# EAGLE schematic matrix mixer (EAGLE 8.2.1)
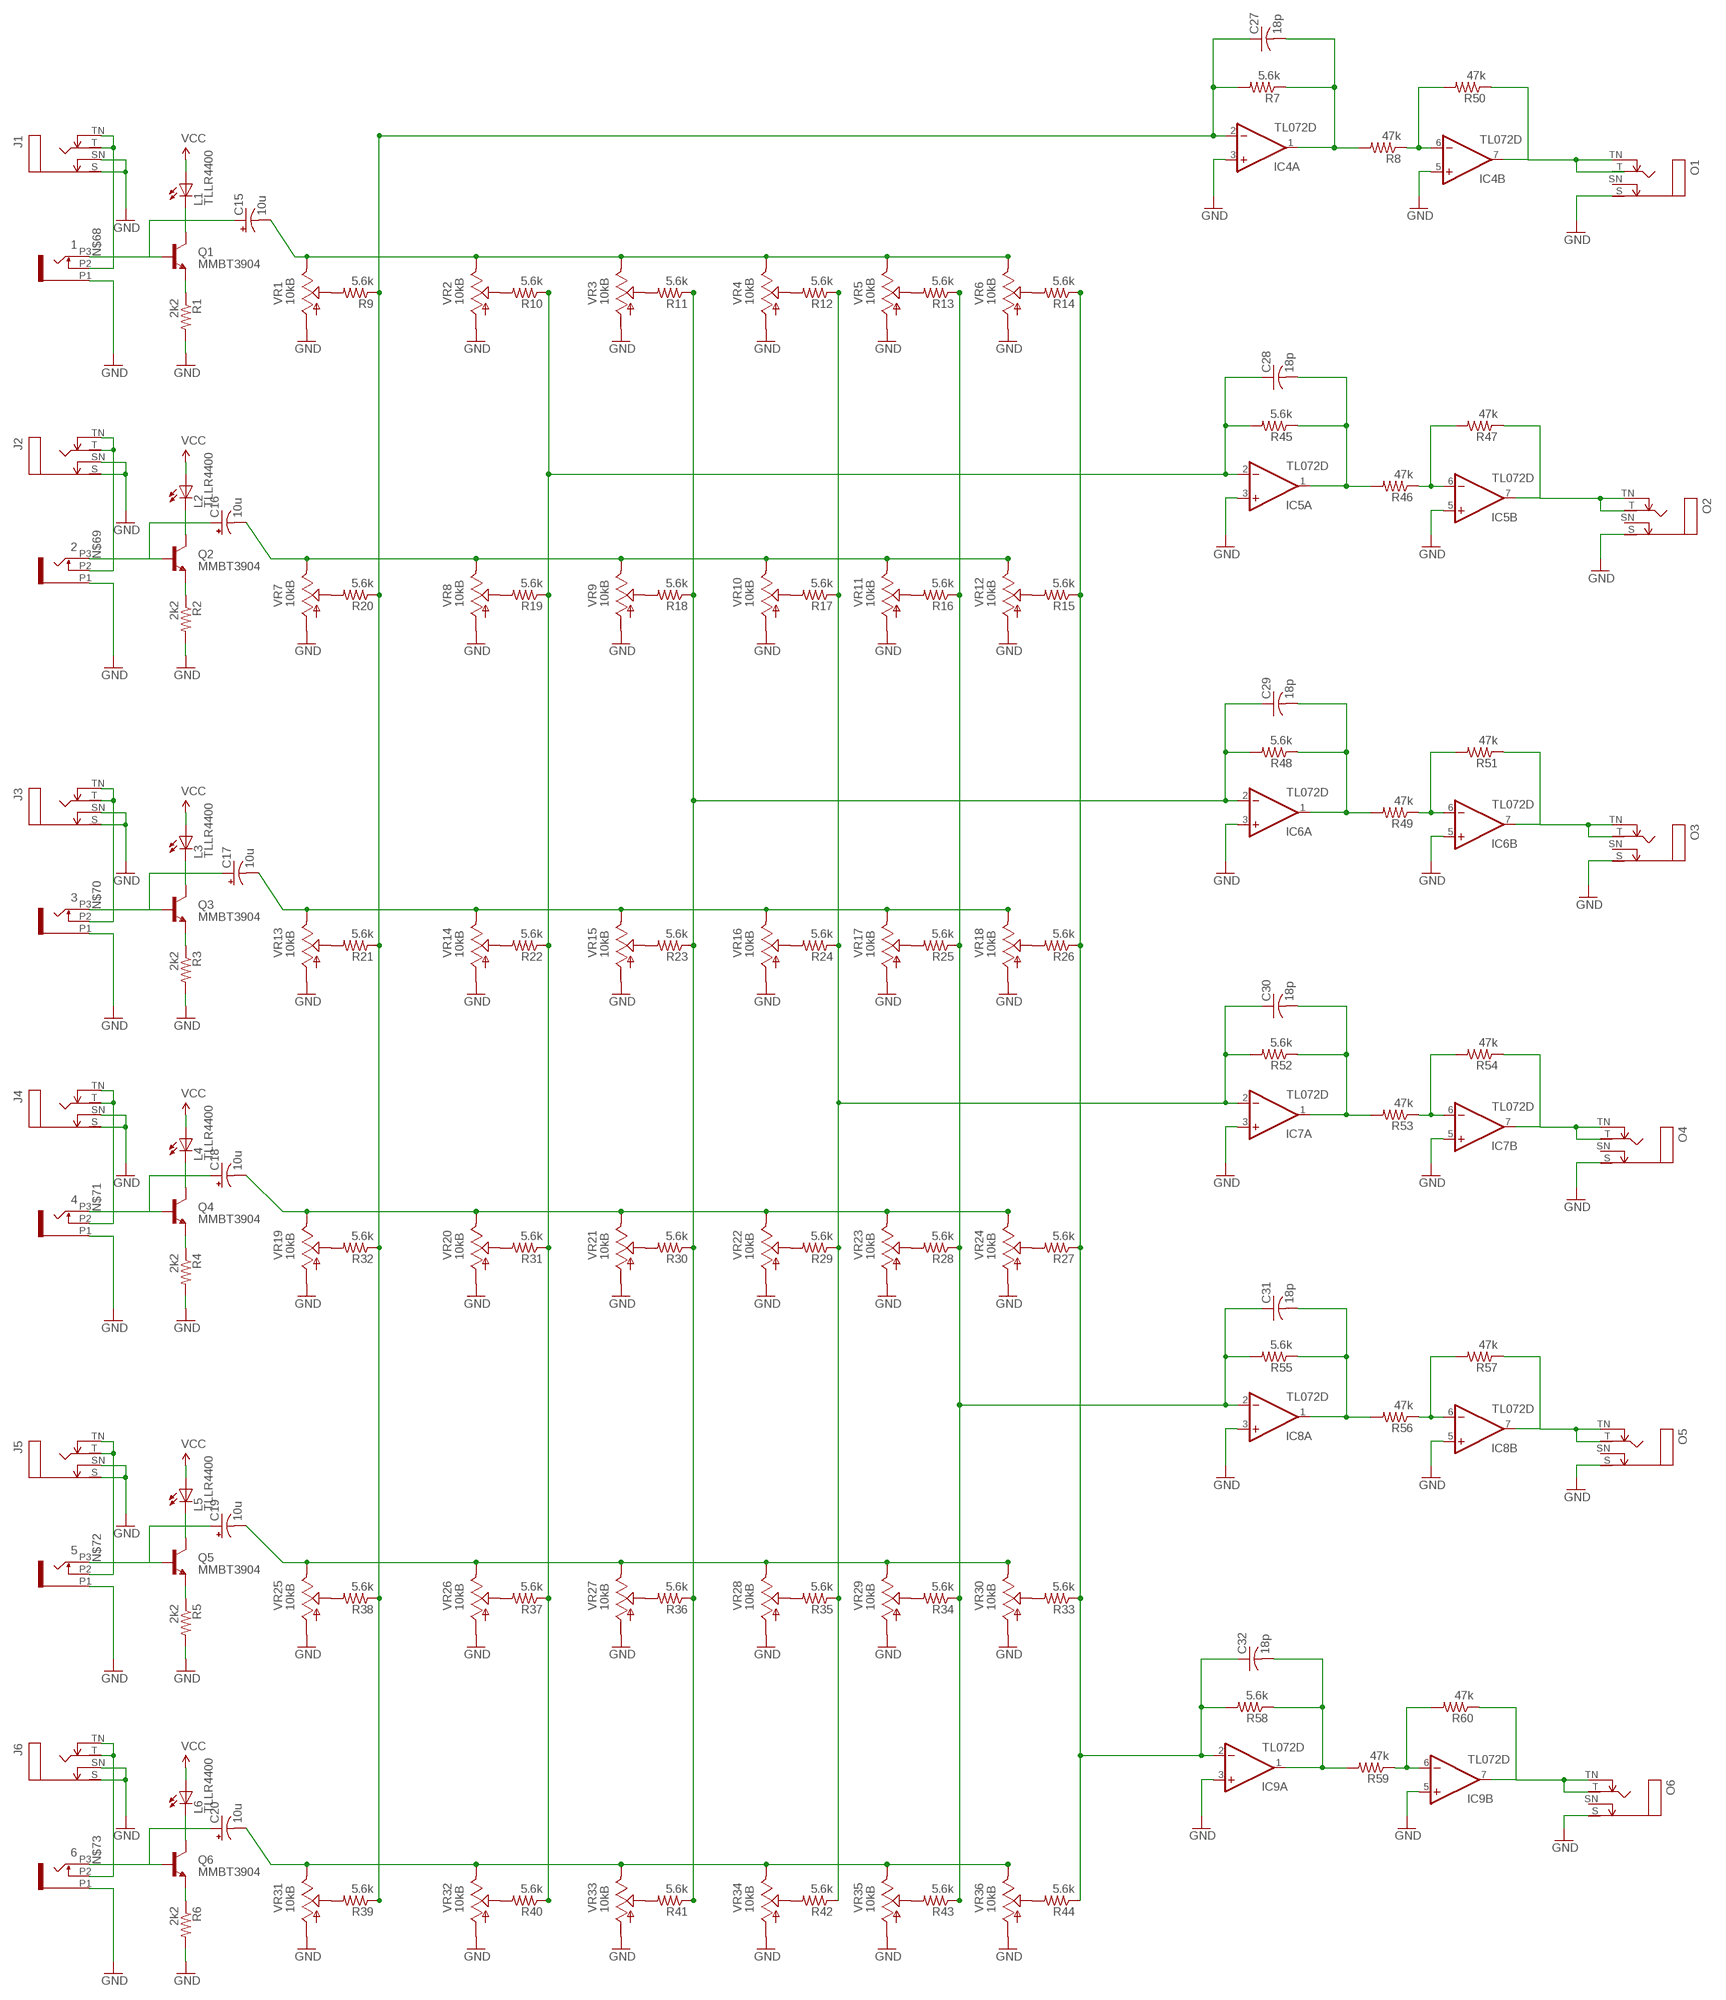
[diagram p0: schematic, sheet 1, part 1 of 2]
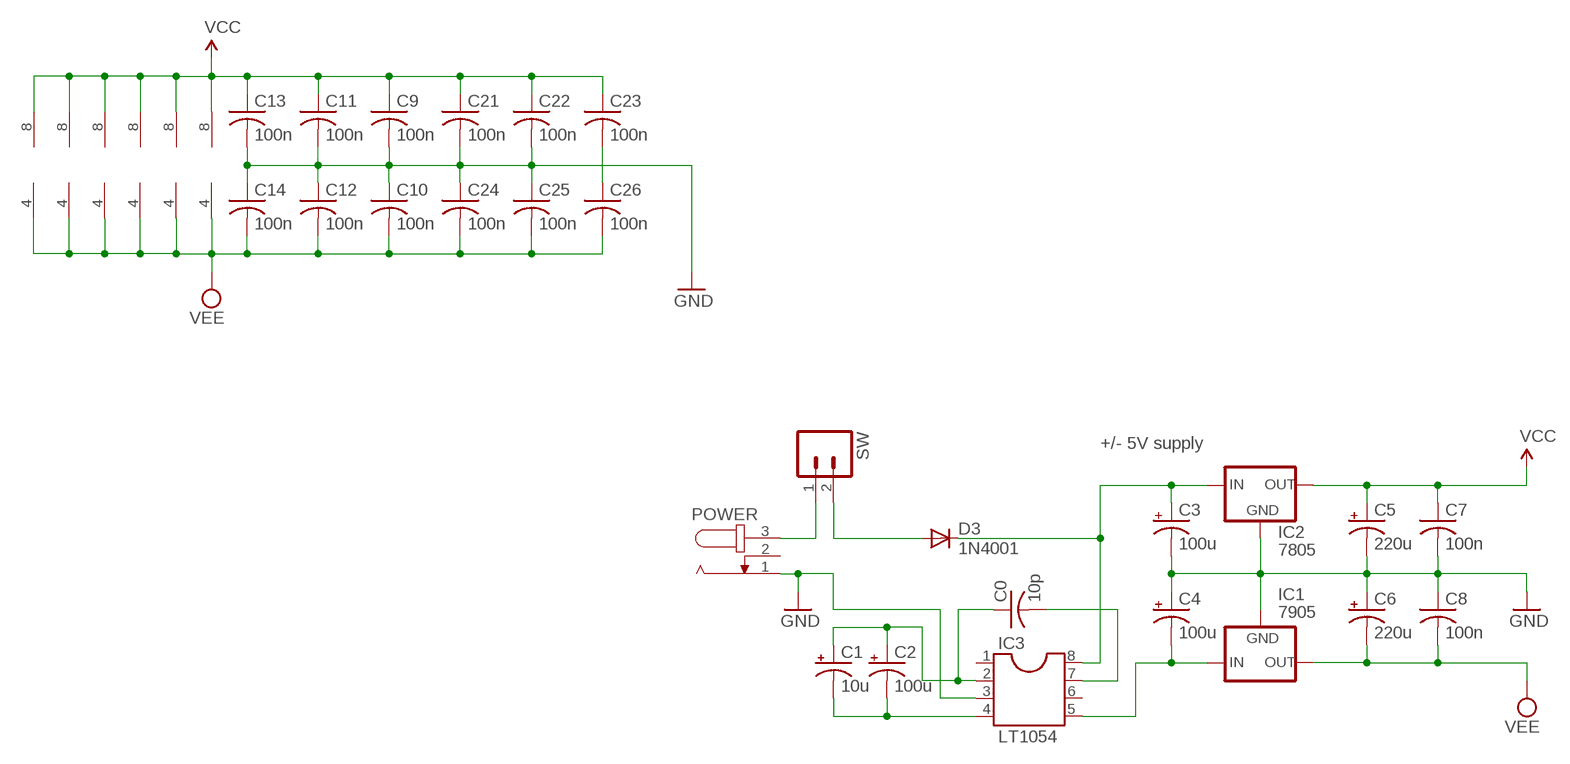
[diagram p1: schematic, sheet 1, part 2 of 2]

## Parts
1  PJ301_THONKICONN6  [WQP_PJ_301M6]
2  PJ301_THONKICONN6  [WQP_PJ_301M6]
3  PJ301_THONKICONN6  [WQP_PJ_301M6]
4  PJ301_THONKICONN6  [WQP_PJ_301M6]
5  PJ301_THONKICONN6  [WQP_PJ_301M6]
6  PJ301_THONKICONN6  [WQP_PJ_301M6]
C0  10p  C-US025-025X050  [C025-025X050]
C1  10u  CPOL-USE2.5-5  [E2,5-5]
C2  100u  CPOL-USE2.5-6  [E2,5-6]
C3  100u  CPOL-USE2.5-7  [E2,5-7]
C4  100u  CPOL-USE2.5-7  [E2,5-7]
C5  220u  CPOL-USE5-10.5  [E5-10,5]
C6  220u  CPOL-USE5-10.5  [E5-10,5]
C7  100n  C-US025-025X050  [C025-025X050]
C8  100n  C-US025-025X050  [C025-025X050]
C9  100n  C-USC0603  [C0603]
C10  100n  C-USC0603  [C0603]
C11  100n  C-USC0603  [C0603]
C12  100n  C-USC0603  [C0603]
C13  100n  C-USC0603  [C0603]
C14  100n  C-USC0603  [C0603]
C15  10u  CPOL-USB  [PANASONIC_B]
C16  10u  CPOL-USB  [PANASONIC_B]
C17  10u  CPOL-USB  [PANASONIC_B]
C18  10u  CPOL-USB  [PANASONIC_B]
C19  10u  CPOL-USB  [PANASONIC_B]
C20  10u  CPOL-USB  [PANASONIC_B]
C21  100n  C-USC0603  [C0603]
C22  100n  C-USC0603  [C0603]
C23  100n  C-USC0603  [C0603]
C24  100n  C-USC0603  [C0603]
C25  100n  C-USC0603  [C0603]
C26  100n  C-USC0603  [C0603]
C27  18p  C-USC0603  [C0603]
C28  18p  C-USC0603  [C0603]
C29  18p  C-USC0603  [C0603]
C30  18p  C-USC0603  [C0603]
C31  18p  C-USC0603  [C0603]
C32  18p  C-USC0603  [C0603]
D3  1N4001  1N4004  [DO41-10]
IC1  7905  79XXS  [79XXS]
IC2  7805  78XXS  [78XXS]
IC3  LT1054  DIL8  [DIL08]
IC4  TL072D  [SO08]
IC5  TL072D  [SO08]
IC6  TL072D  [SO08]
IC7  TL072D  [SO08]
IC8  TL072D  [SO08]
IC9  TL072D  [SO08]
J1  MONOSWS  [NMJ4HC-S]
J2  MONOSWS  [NMJ4HC-S]
J3  MONOSWS  [NMJ4HC-S]
J4  MONOSWS  [NMJ4HC-S]
J5  MONOSWS  [NMJ4HC-S]
J6  MONOSWS  [NMJ4HC-S]
L1  TLLR4400  [LED3MM]
L2  TLLR4400  [LED3MM]
L3  TLLR4400  [LED3MM]
L4  TLLR4400  [LED3MM]
L5  TLLR4400  [LED3MM]
L6  TLLR4400  [LED3MM]
O1  MONOSWS  [NMJ4HC-S]
O2  MONOSWS  [NMJ4HC-S]
O3  MONOSWS  [NMJ4HC-S]
O4  MONOSWS  [NMJ4HC-S]
O5  MONOSWS  [NMJ4HC-S]
O6  MONOSWS  [NMJ4HC-S]
POWER  JACK-PLUG2  [SPC4078_BIG_HOLES]
Q1  MMBT3904  MMBT3904LT1-NPN-SOT23-BEC  [SOT23-BEC]
Q2  MMBT3904  MMBT3904LT1-NPN-SOT23-BEC  [SOT23-BEC]
Q3  MMBT3904  MMBT3904LT1-NPN-SOT23-BEC  [SOT23-BEC]
Q4  MMBT3904  MMBT3904LT1-NPN-SOT23-BEC  [SOT23-BEC]
Q5  MMBT3904  MMBT3904LT1-NPN-SOT23-BEC  [SOT23-BEC]
Q6  MMBT3904  MMBT3904LT1-NPN-SOT23-BEC  [SOT23-BEC]
R1  2k2  R-US_R0603  [R0603]
R2  2k2  R-US_R0603  [R0603]
R3  2k2  R-US_R0603  [R0603]
R4  2k2  R-US_R0603  [R0603]
R5  2k2  R-US_R0603  [R0603]
R6  2k2  R-US_R0603  [R0603]
R7  5.6k  R-US_R0603  [R0603]
R8  47k  R-US_R0603  [R0603]
R9  5.6k  R-US_R0603  [R0603]
R10  5.6k  R-US_R0603  [R0603]
R11  5.6k  R-US_R0603  [R0603]
R12  5.6k  R-US_R0603  [R0603]
R13  5.6k  R-US_R0603  [R0603]
R14  5.6k  R-US_R0603  [R0603]
R15  5.6k  R-US_R0603  [R0603]
R16  5.6k  R-US_R0603  [R0603]
R17  5.6k  R-US_R0603  [R0603]
R18  5.6k  R-US_R0603  [R0603]
R19  5.6k  R-US_R0603  [R0603]
R20  5.6k  R-US_R0603  [R0603]
R21  5.6k  R-US_R0603  [R0603]
R22  5.6k  R-US_R0603  [R0603]
R23  5.6k  R-US_R0603  [R0603]
R24  5.6k  R-US_R0603  [R0603]
R25  5.6k  R-US_R0603  [R0603]
R26  5.6k  R-US_R0603  [R0603]
R27  5.6k  R-US_R0603  [R0603]
R28  5.6k  R-US_R0603  [R0603]
R29  5.6k  R-US_R0603  [R0603]
R30  5.6k  R-US_R0603  [R0603]
R31  5.6k  R-US_R0603  [R0603]
R32  5.6k  R-US_R0603  [R0603]
R33  5.6k  R-US_R0603  [R0603]
R34  5.6k  R-US_R0603  [R0603]
R35  5.6k  R-US_R0603  [R0603]
R36  5.6k  R-US_R0603  [R0603]
R37  5.6k  R-US_R0603  [R0603]
R38  5.6k  R-US_R0603  [R0603]
R39  5.6k  R-US_R0603  [R0603]
R40  5.6k  R-US_R0603  [R0603]
R41  5.6k  R-US_R0603  [R0603]
R42  5.6k  R-US_R0603  [R0603]
R43  5.6k  R-US_R0603  [R0603]
R44  5.6k  R-US_R0603  [R0603]
R45  5.6k  R-US_R0603  [R0603]
R46  47k  R-US_R0603  [R0603]
R47  47k  R-US_R0603  [R0603]
R48  5.6k  R-US_R0603  [R0603]
R49  47k  R-US_R0603  [R0603]
R50  47k  R-US_R0603  [R0603]
R51  47k  R-US_R0603  [R0603]
R52  5.6k  R-US_R0603  [R0603]
R53  47k  R-US_R0603  [R0603]
R54  47k  R-US_R0603  [R0603]
R55  5.6k  R-US_R0603  [R0603]
R56  47k  R-US_R0603  [R0603]
R57  47k  R-US_R0603  [R0603]
R58  5.6k  R-US_R0603  [R0603]
R59  47k  R-US_R0603  [R0603]
R60  47k  R-US_R0603  [R0603]
SW  M02PTH  [1X02]
VR1  10kB  POT_USVERTICAL_PS  [ALPS_POT_VERTICAL_PS]
VR2  10kB  POT_USVERTICAL_PS  [ALPS_POT_VERTICAL_PS]
VR3  10kB  POT_USVERTICAL_PS  [ALPS_POT_VERTICAL_PS]
VR4  10kB  POT_USVERTICAL_PS  [ALPS_POT_VERTICAL_PS]
VR5  10kB  POT_USVERTICAL_PS  [ALPS_POT_VERTICAL_PS]
VR6  10kB  POT_USVERTICAL_PS  [ALPS_POT_VERTICAL_PS]
VR7  10kB  POT_USVERTICAL_PS  [ALPS_POT_VERTICAL_PS]
VR8  10kB  POT_USVERTICAL_PS  [ALPS_POT_VERTICAL_PS]
VR9  10kB  POT_USVERTICAL_PS  [ALPS_POT_VERTICAL_PS]
VR10  10kB  POT_USVERTICAL_PS  [ALPS_POT_VERTICAL_PS]
VR11  10kB  POT_USVERTICAL_PS  [ALPS_POT_VERTICAL_PS]
VR12  10kB  POT_USVERTICAL_PS  [ALPS_POT_VERTICAL_PS]
VR13  10kB  POT_USVERTICAL_PS  [ALPS_POT_VERTICAL_PS]
VR14  10kB  POT_USVERTICAL_PS  [ALPS_POT_VERTICAL_PS]
VR15  10kB  POT_USVERTICAL_PS  [ALPS_POT_VERTICAL_PS]
VR16  10kB  POT_USVERTICAL_PS  [ALPS_POT_VERTICAL_PS]
VR17  10kB  POT_USVERTICAL_PS  [ALPS_POT_VERTICAL_PS]
VR18  10kB  POT_USVERTICAL_PS  [ALPS_POT_VERTICAL_PS]
VR19  10kB  POT_USVERTICAL_PS  [ALPS_POT_VERTICAL_PS]
VR20  10kB  POT_USVERTICAL_PS  [ALPS_POT_VERTICAL_PS]
VR21  10kB  POT_USVERTICAL_PS  [ALPS_POT_VERTICAL_PS]
VR22  10kB  POT_USVERTICAL_PS  [ALPS_POT_VERTICAL_PS]
VR23  10kB  POT_USVERTICAL_PS  [ALPS_POT_VERTICAL_PS]
VR24  10kB  POT_USVERTICAL_PS  [ALPS_POT_VERTICAL_PS]
VR25  10kB  POT_USVERTICAL_PS  [ALPS_POT_VERTICAL_PS]
VR26  10kB  POT_USVERTICAL_PS  [ALPS_POT_VERTICAL_PS]
VR27  10kB  POT_USVERTICAL_PS  [ALPS_POT_VERTICAL_PS]
VR28  10kB  POT_USVERTICAL_PS  [ALPS_POT_VERTICAL_PS]
VR29  10kB  POT_USVERTICAL_PS  [ALPS_POT_VERTICAL_PS]
VR30  10kB  POT_USVERTICAL_PS  [ALPS_POT_VERTICAL_PS]
VR31  10kB  POT_USVERTICAL_PS  [ALPS_POT_VERTICAL_PS]
VR32  10kB  POT_USVERTICAL_PS  [ALPS_POT_VERTICAL_PS]
VR33  10kB  POT_USVERTICAL_PS  [ALPS_POT_VERTICAL_PS]
VR34  10kB  POT_USVERTICAL_PS  [ALPS_POT_VERTICAL_PS]
VR35  10kB  POT_USVERTICAL_PS  [ALPS_POT_VERTICAL_PS]
VR36  10kB  POT_USVERTICAL_PS  [ALPS_POT_VERTICAL_PS]

## Nets
GND: 1.P1 2.P1 3.P1 4.P1 5.P1 6.P1 C3.- C4.+ C5.- C6.+ C7.2 C8.1 C9.2 C10.1 C11.2 C12.1 C13.2 C14.1 C21.2 C22.2 C23.2 C24.1 C25.1 C26.1 IC1.GND IC2.GND IC3.3 IC4.3(A:+IN) IC4.5(B:+IN) IC5.3(A:+IN) IC5.5(B:+IN) IC6.3(A:+IN) IC6.5(B:+IN) IC7.3(A:+IN) IC7.5(B:+IN) IC8.3(A:+IN) IC8.5(B:+IN) IC9.3(A:+IN) IC9.5(B:+IN) J1.S J1.SN J2.S J2.SN J3.S J3.SN J4.S J4.SN J5.S J5.SN J6.S J6.SN O1.S O2.S O3.S O4.S O5.S O6.S POWER.1 R1.2 R2.2 R3.2 R4.2 R5.2 R6.2 VR1.P$3(A) VR2.P$3(A) VR3.P$3(A) VR4.P$3(A) VR5.P$3(A) VR6.P$3(A) VR7.P$3(A) VR8.P$3(A) VR9.P$3(A) VR10.P$3(A) VR11.P$3(A) VR12.P$3(A) VR13.P$3(A) VR14.P$3(A) VR15.P$3(A) VR16.P$3(A) VR17.P$3(A) VR18.P$3(A) VR19.P$3(A) VR20.P$3(A) VR21.P$3(A) VR22.P$3(A) VR23.P$3(A) VR24.P$3(A) VR25.P$3(A) VR26.P$3(A) VR27.P$3(A) VR28.P$3(A) VR29.P$3(A) VR30.P$3(A) VR31.P$3(A) VR32.P$3(A) VR33.P$3(A) VR34.P$3(A) VR35.P$3(A) VR36.P$3(A)
INPUT_1: C15.- VR1.P$1(E) VR2.P$1(E) VR3.P$1(E) VR4.P$1(E) VR5.P$1(E) VR6.P$1(E)
INPUT_2: C16.- VR7.P$1(E) VR8.P$1(E) VR9.P$1(E) VR10.P$1(E) VR11.P$1(E) VR12.P$1(E)
INPUT_3: C17.- VR13.P$1(E) VR14.P$1(E) VR15.P$1(E) VR16.P$1(E) VR17.P$1(E) VR18.P$1(E)
INPUT_4: C18.- VR19.P$1(E) VR20.P$1(E) VR21.P$1(E) VR22.P$1(E) VR23.P$1(E) VR24.P$1(E)
INPUT_5: C19.- VR25.P$1(E) VR26.P$1(E) VR27.P$1(E) VR28.P$1(E) VR29.P$1(E) VR30.P$1(E)
INPUT_6: C20.- VR31.P$1(E) VR32.P$1(E) VR33.P$1(E) VR34.P$1(E) VR35.P$1(E) VR36.P$1(E)
N$1: R9.2 VR1.P$2(S)
N$2: Q2.E R2.1
N$3: Q1.E R1.1
N$4: R10.2 VR2.P$2(S)
N$5: R11.2 VR3.P$2(S)
N$6: 1.P2 J1.T J1.TN
N$7: L2.K(C) Q2.C
N$8: L1.K(C) Q1.C
N$9: R12.2 VR4.P$2(S)
N$10: R13.2 VR5.P$2(S)
N$11: R14.2 VR6.P$2(S)
N$12: L4.K(C) Q4.C
N$13: R15.2 VR12.P$2(S)
N$14: R16.2 VR11.P$2(S)
N$15: L3.K(C) Q3.C
N$16: R17.2 VR10.P$2(S)
N$17: R18.2 VR9.P$2(S)
N$18: R19.2 VR8.P$2(S)
N$19: R20.2 VR7.P$2(S)
N$20: Q4.E R4.1
N$21: R21.2 VR13.P$2(S)
N$22: R22.2 VR14.P$2(S)
N$23: R23.2 VR15.P$2(S)
N$24: R24.2 VR16.P$2(S)
N$25: R25.2 VR17.P$2(S)
N$26: R26.2 VR18.P$2(S)
N$27: Q3.E R3.1
N$28: R27.2 VR24.P$2(S)
N$29: L6.K(C) Q6.C
N$30: L5.K(C) Q5.C
N$31: Q6.E R6.1
N$32: Q5.E R5.1
N$33: 2.P2 J2.T J2.TN
N$34: 3.P2 J3.T J3.TN
N$35: 4.P2 J4.T J4.TN
N$36: 5.P2 J5.T J5.TN
N$37: 6.P2 J6.T J6.TN
N$38: R28.2 VR23.P$2(S)
N$39: R29.2 VR22.P$2(S)
N$40: R30.2 VR21.P$2(S)
N$41: R31.2 VR20.P$2(S)
N$42: R32.2 VR19.P$2(S)
N$43: R33.2 VR30.P$2(S)
N$44: POWER.3 SW.1
N$45: R34.2 VR29.P$2(S)
N$46: C3.+ D3.C IC2.IN IC3.8
N$47: C0.1 C1.+ C2.+ IC3.2
N$48: C1.- C2.- IC3.4
N$49: C0.2 IC3.7
N$50: R35.2 VR28.P$2(S)
N$51: R36.2 VR27.P$2(S)
N$52: R37.2 VR26.P$2(S)
N$53: R38.2 VR25.P$2(S)
N$54: R39.2 VR31.P$2(S)
N$55: R40.2 VR32.P$2(S)
N$56: R41.2 VR33.P$2(S)
N$57: R42.2 VR34.P$2(S)
N$58: C4.- IC1.IN IC3.5
N$59: D3.A SW.2
N$60: R43.2 VR35.P$2(S)
N$61: R44.2 VR36.P$2(S)
N$62: C27.1 IC4.2(A:-IN) R7.2 R9.1 R20.1 R21.1 R32.1 R38.1 R39.1
N$63: C28.1 IC5.2(A:-IN) R10.1 R19.1 R22.1 R31.1 R37.1 R40.1 R45.2
N$64: C29.1 IC6.2(A:-IN) R11.1 R18.1 R23.1 R30.1 R36.1 R41.1 R48.2
N$65: C30.1 IC7.2(A:-IN) R12.1 R17.1 R24.1 R29.1 R35.1 R42.1 R52.2
N$66: C31.1 IC8.2(A:-IN) R13.1 R16.1 R25.1 R28.1 R34.1 R43.1 R55.2
N$67: C32.1 IC9.2(A:-IN) R14.1 R15.1 R26.1 R27.1 R33.1 R44.1 R58.2
N$68: 1.P3 C15.+ Q1.B
N$69: 2.P3 C16.+ Q2.B
N$70: 3.P3 C17.+ Q3.B
N$71: 4.P3 C18.+ Q4.B
N$72: 5.P3 C19.+ Q5.B
N$73: 6.P3 C20.+ Q6.B
N$74: C27.2 IC4.1(A:OUT) R7.1 R8.2
N$75: IC4.6(B:-IN) R8.1 R50.2
N$76: IC4.7(B:OUT) O1.TN R50.1
N$78: C28.2 IC5.1(A:OUT) R45.1 R46.2
N$79: IC5.6(B:-IN) R46.1 R47.2
N$80: IC5.7(B:OUT) O2.T O2.TN R47.1
N$83: C29.2 IC6.1(A:OUT) R48.1 R49.2
N$84: IC6.6(B:-IN) R49.1 R51.2
N$85: IC6.7(B:OUT) O3.T O3.TN R51.1
N$86: C30.2 IC7.1(A:OUT) R52.1 R53.2
N$87: IC7.6(B:-IN) R53.1 R54.2
N$88: IC7.7(B:OUT) O4.T O4.TN R54.1
N$90: C31.2 IC8.1(A:OUT) R55.1 R56.2
N$91: IC8.6(B:-IN) R56.1 R57.2
N$92: IC8.7(B:OUT) O5.T O5.TN R57.1
N$94: C32.2 IC9.1(A:OUT) R58.1 R59.2
N$95: IC9.6(B:-IN) R59.1 R60.2
N$96: IC9.7(B:OUT) O6.T O6.TN R60.1
VCC: C5.+ C7.1 C9.1 C11.1 C13.1 C21.1 C22.1 C23.1 IC2.OUT IC4.8(P:V+) IC5.8(P:V+) IC6.8(P:V+) IC7.8(P:V+) IC8.8(P:V+) IC9.8(P:V+) L1.A L2.A L3.A L4.A L5.A L6.A
VEE: C6.- C8.2 C10.2 C12.2 C14.2 C24.2 C25.2 C26.2 IC1.OUT IC4.4(P:V-) IC5.4(P:V-) IC6.4(P:V-) IC7.4(P:V-) IC8.4(P:V-) IC9.4(P:V-)
Unconnected: IC3.1 IC3.6 O1.SN O1.T O2.SN O3.SN O4.SN O5.SN O6.SN POWER.2

## Notes on the sheet
- +/- 5V supply

## Library data of the parts
1-6 = og-pj301:PJ301_THONKICONN
C0 C7-C14 C21-C32 = rcl:C-US: CAPACITOR, American symbol
C1-C6 C15-C20 = rcl:CPOL-US: POLARIZED CAPACITOR, American symbol
D3 = diode:1N4004: DIODE general purpose rectifier, 1 A
IC1 = v-reg:79XXS: VOLTAGE REGULATOR
IC2 = v-reg:78XXS: VOLTAGE REGULATOR
IC3 = ic-package:DIL8: Dual In Line / Socket
IC4-IC9 = linear:TL072: OP AMP
J1-J6 O1-O6 = og-neutrik:MONOSW
L1-L6 = led:TLLR4400: Low Current (2mA) LED 3 mm Tinted Diffused Package color RED Source: Data sheet <http://www.farnell.com/datasheets/391100.pdf>; MF: VISHAY SEMICONDUCTOR; OC_FARNELL: 1612437
POWER = con-jack2:JACK-PLUG: DC POWER JACK Power Jack, DC, Right Angle, Through Hole, Rated 5A at 16VDC, PC Terminals Distributor: Farnell (www.Farnell.de) Drawing: 84N1161.pdf / 84N1162.pdf Manufacturer: SPC Technology (www.spctechnology.com) Type: SPC4077 / SPC 4078
Q1-Q6 = transistor:*-NPN-: NPN Transistror BF959 corrected 2008.03.06
R1-R60 = rcl:R-US_: RESISTOR, American symbol
SW = SparkFun:M02: Header 2 Standard 2-pin 0.1" header. Use with straight break away headers (SKU : PRT-00116), right angle break away headers (PRT-00553), swiss pins (PRT-00743), machine pins (PRT-00117), and female headers (PRT-00115). Molex polarized connector foot print use with SKU : PRT-08233 with associated crimp pins and housings.
VR1-VR36 = pot-alps:POT_US